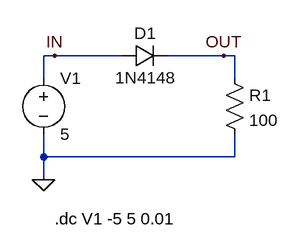
[diagram p0: schematic rectifier_halfwave_DCtransfer.asc]
rectifier_halfwave_DCtransfer.asc, the LTspice schematic file:
Version 4
SHEET 1 1048 956
WIRE 112 464 96 464
WIRE 208 464 112 464
WIRE 352 464 272 464
WIRE 368 464 352 464
WIRE 96 496 96 464
WIRE 368 496 368 464
WIRE 96 608 96 576
WIRE 368 608 368 576
WIRE 368 608 96 608
WIRE 96 640 96 608
FLAG 96 640 0
FLAG 112 464 IN
FLAG 352 464 OUT
SYMBOL diode 208 480 R270
WINDOW 0 32 32 VTop 2
WINDOW 3 0 32 VBottom 2
SYMATTR InstName D1
SYMATTR Value 1N4148
SYMBOL voltage 96 480 R0
WINDOW 123 0 0 Left 0
WINDOW 39 0 0 Left 0
SYMATTR InstName V1
SYMATTR Value 5
SYMBOL res 352 480 R0
SYMATTR InstName R1
SYMATTR Value 100
TEXT 112 696 Left 2 !.dc V1 -5 5 0.01

The netlist it stands for:
* rectifier_halfwave_DCtransfer.asc
D1 IN OUT 1N4148
V1 IN 0 5
R1 OUT 0 100
.model D D
.lib standard.dio
.dc V1 -5 5 0.01
.backanno
.end